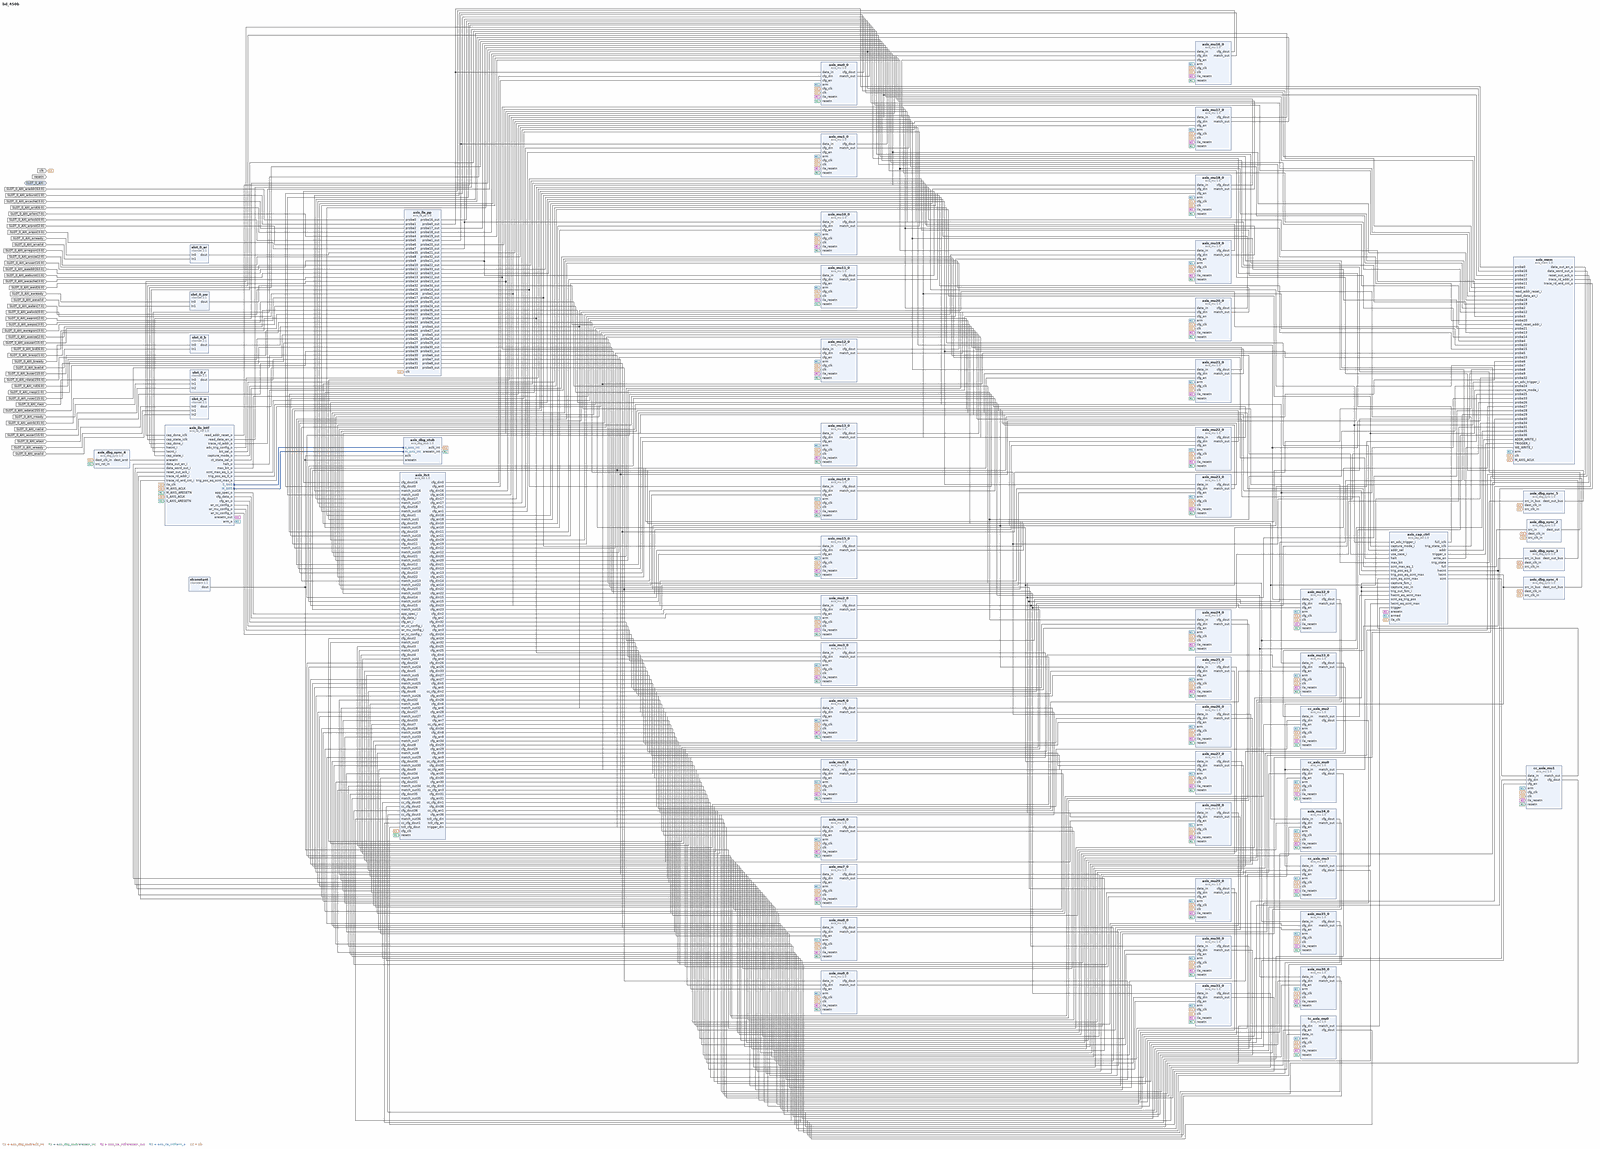
[diagram p0: block diagram of the top level, whole]
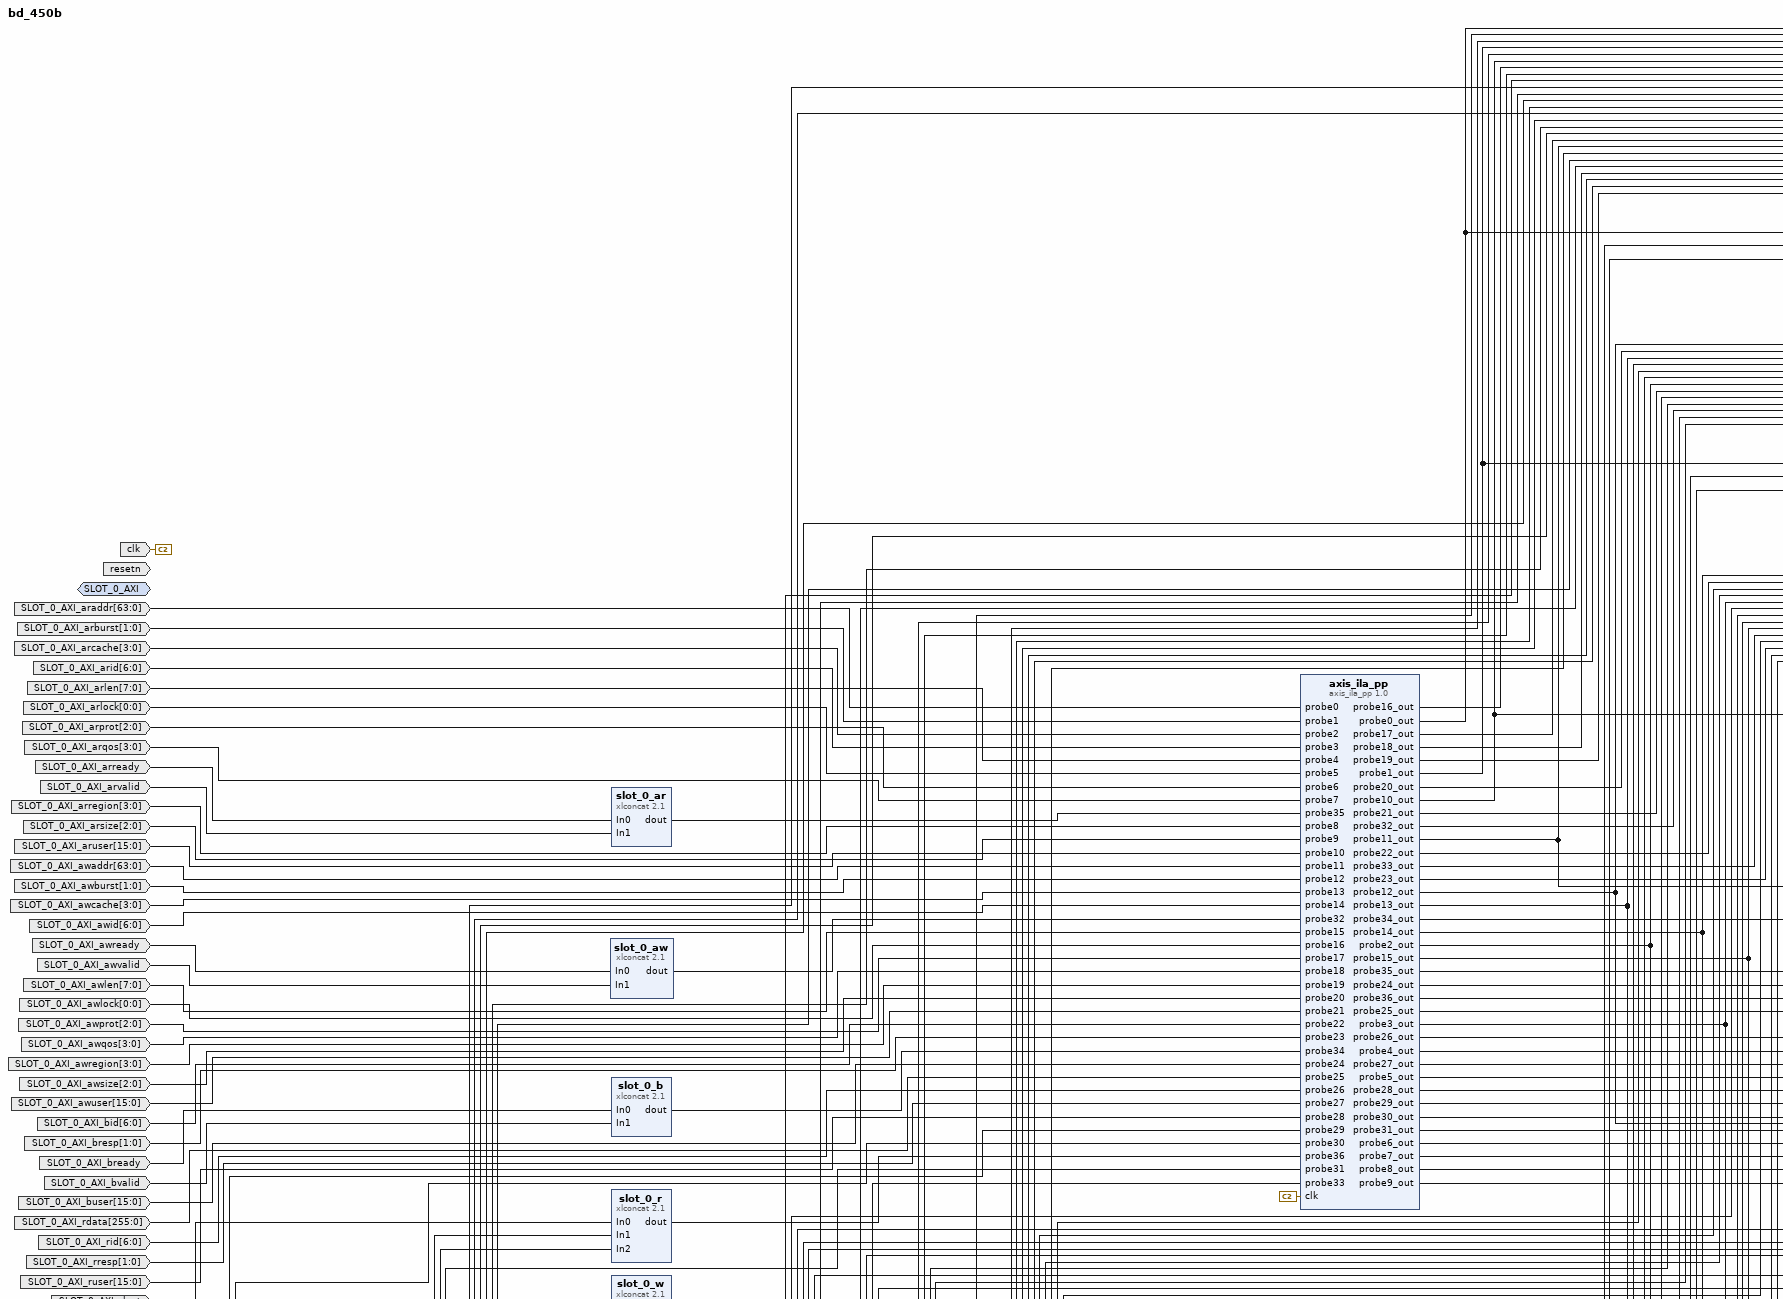
[diagram p1: block diagram of the top level, upper left part]
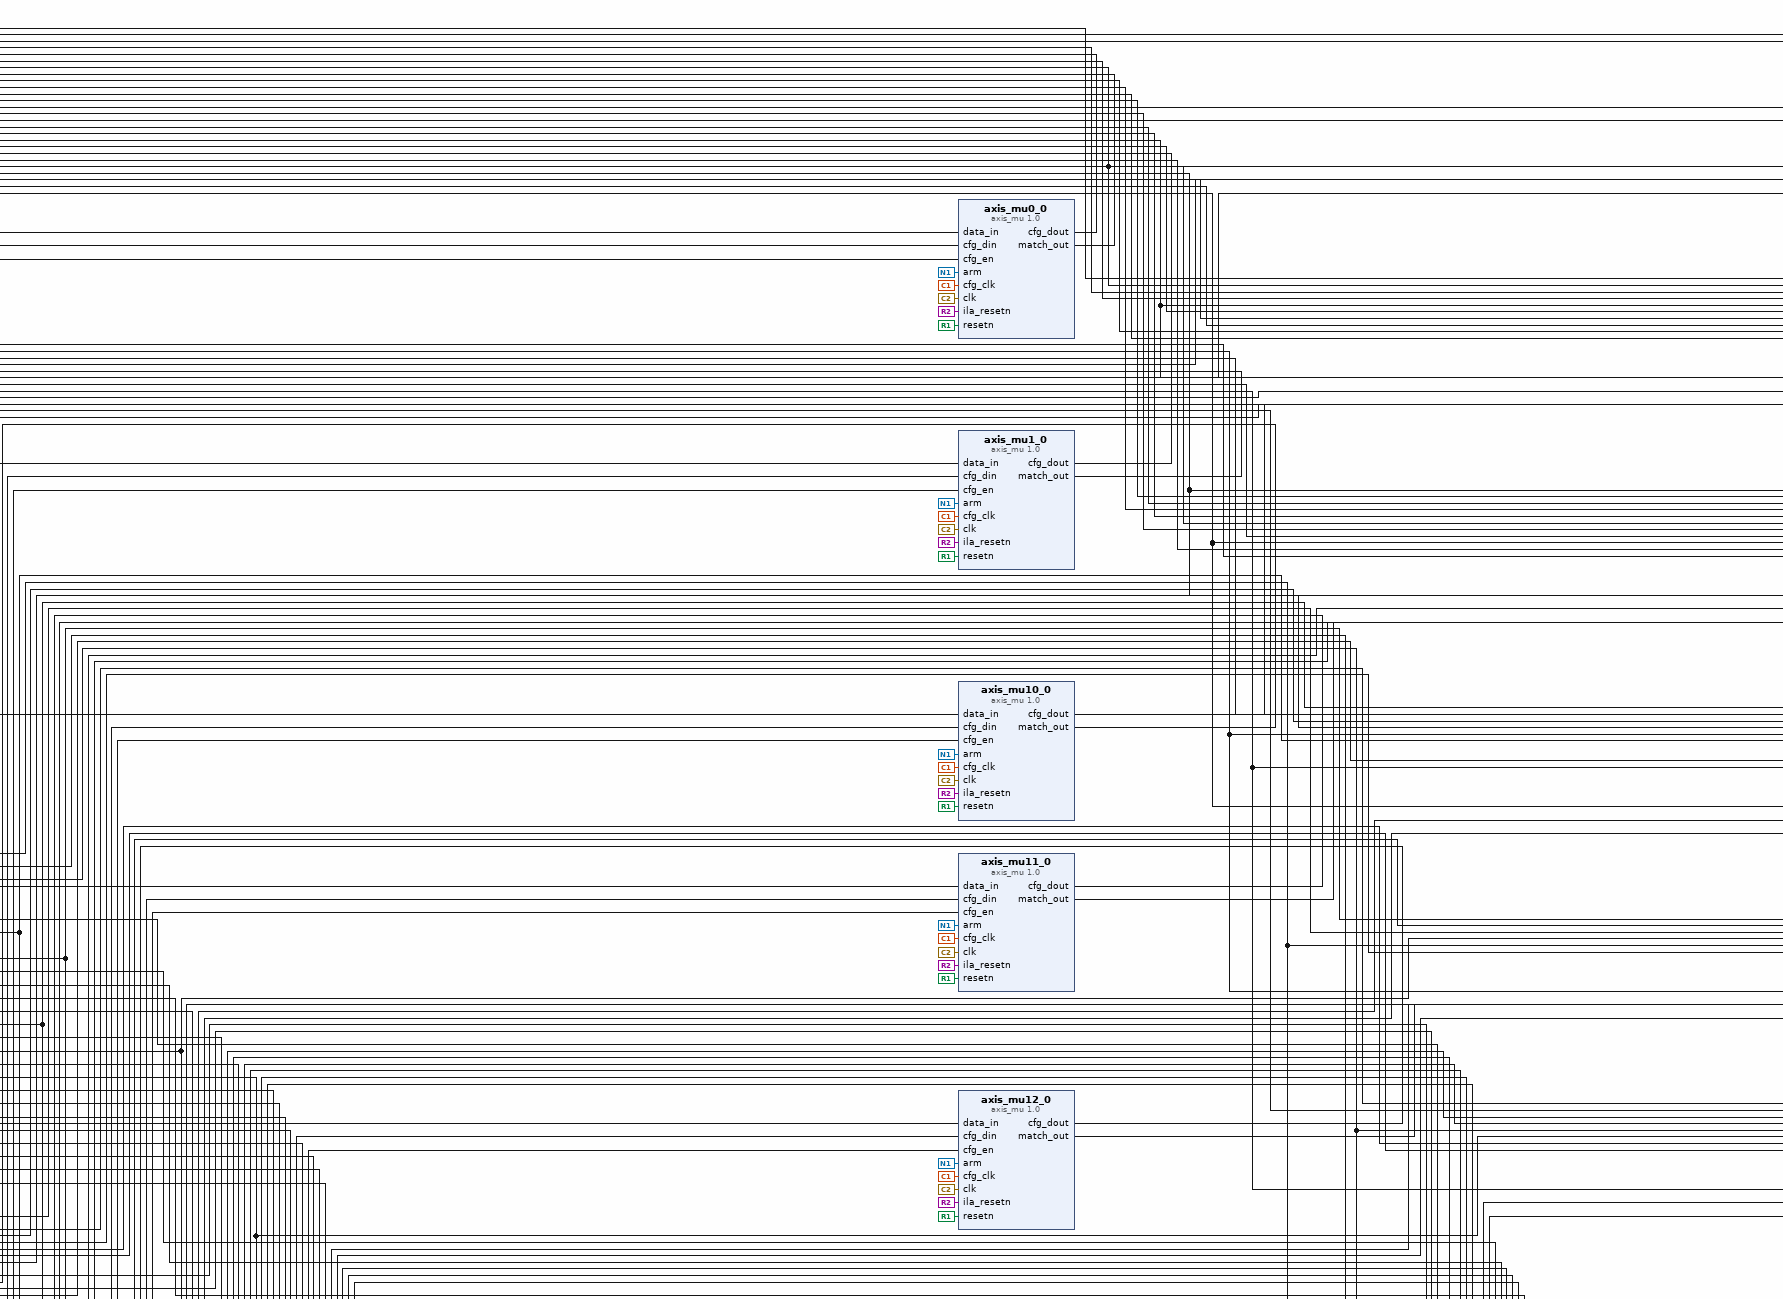
[diagram p2: block diagram of the top level, upper centre part]
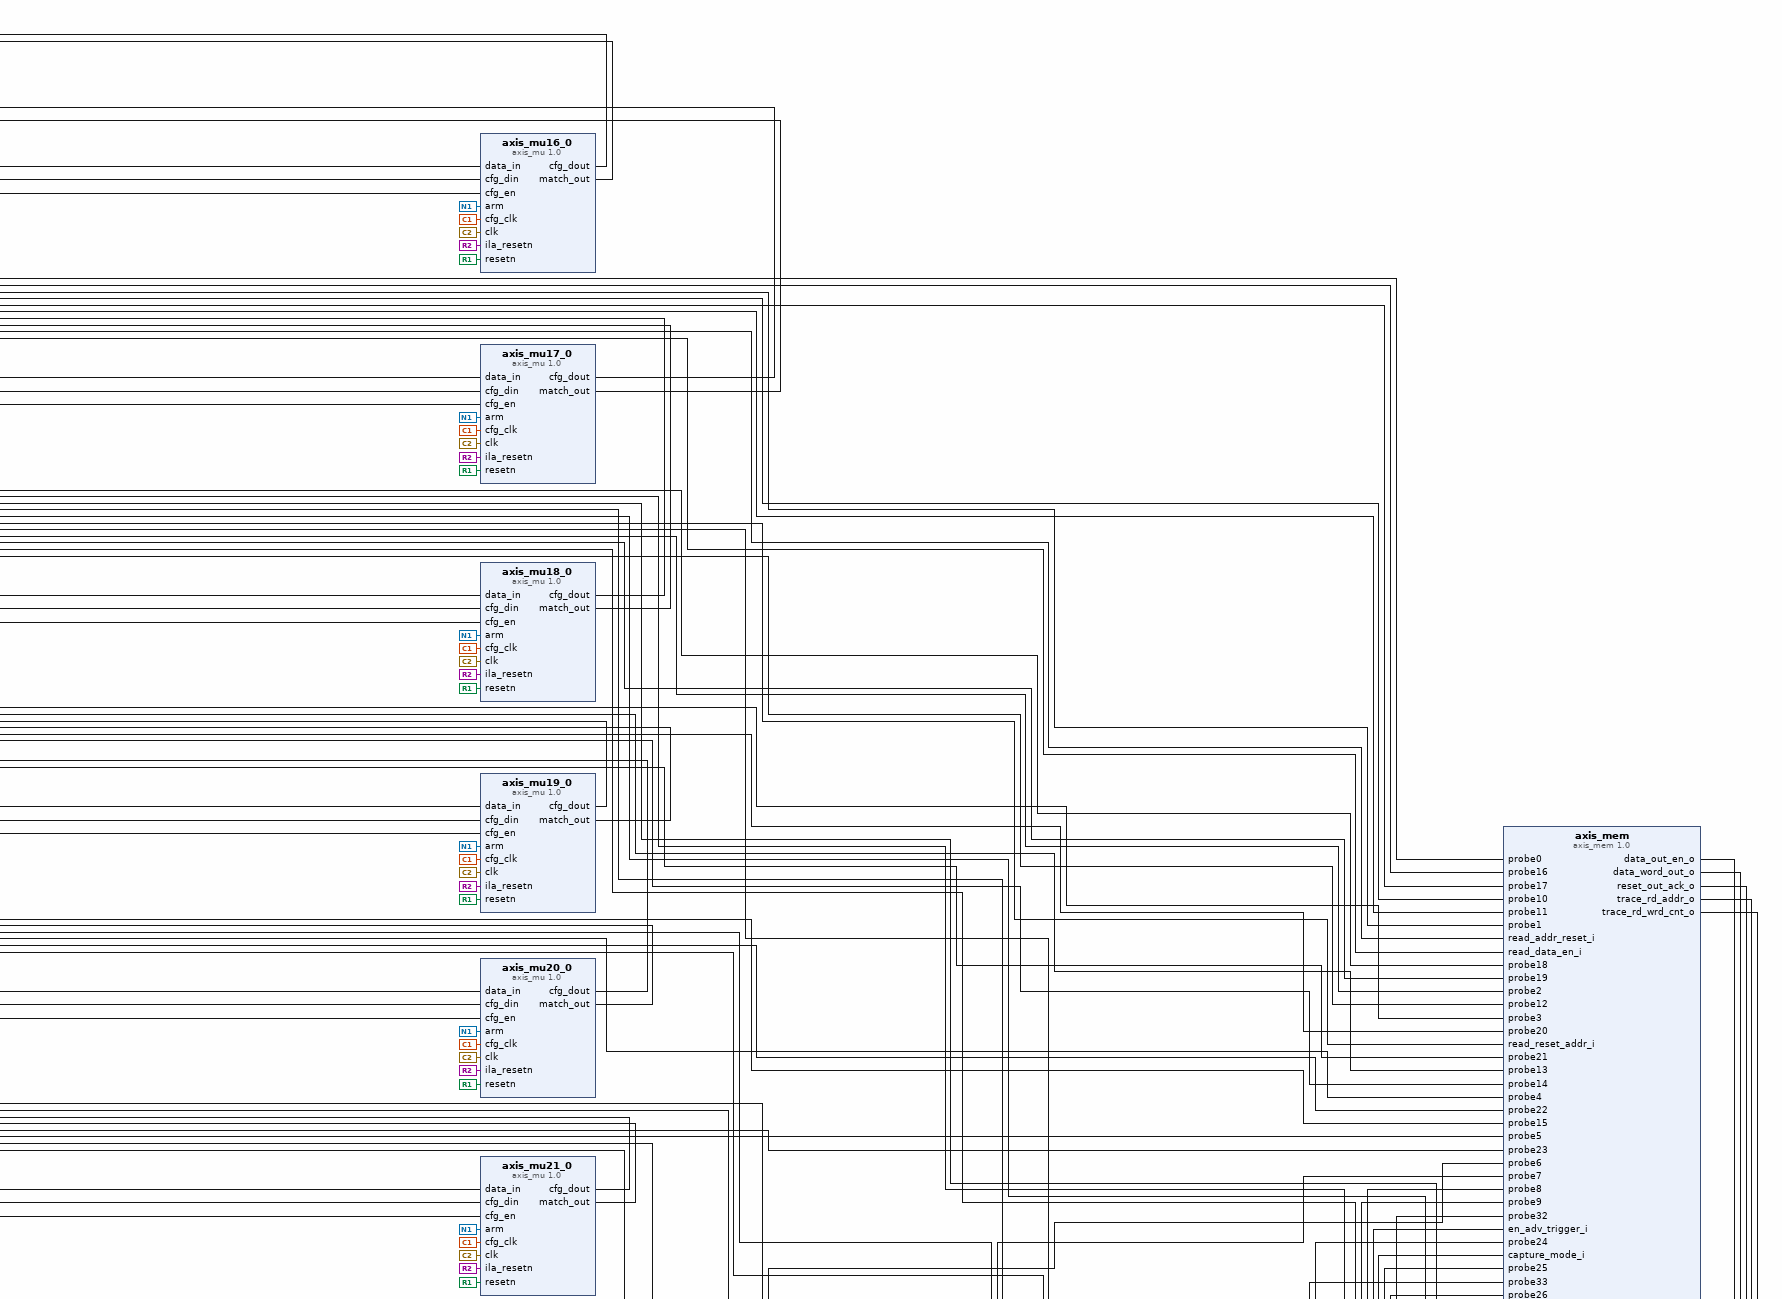
[diagram p3: block diagram of the top level, upper right part]
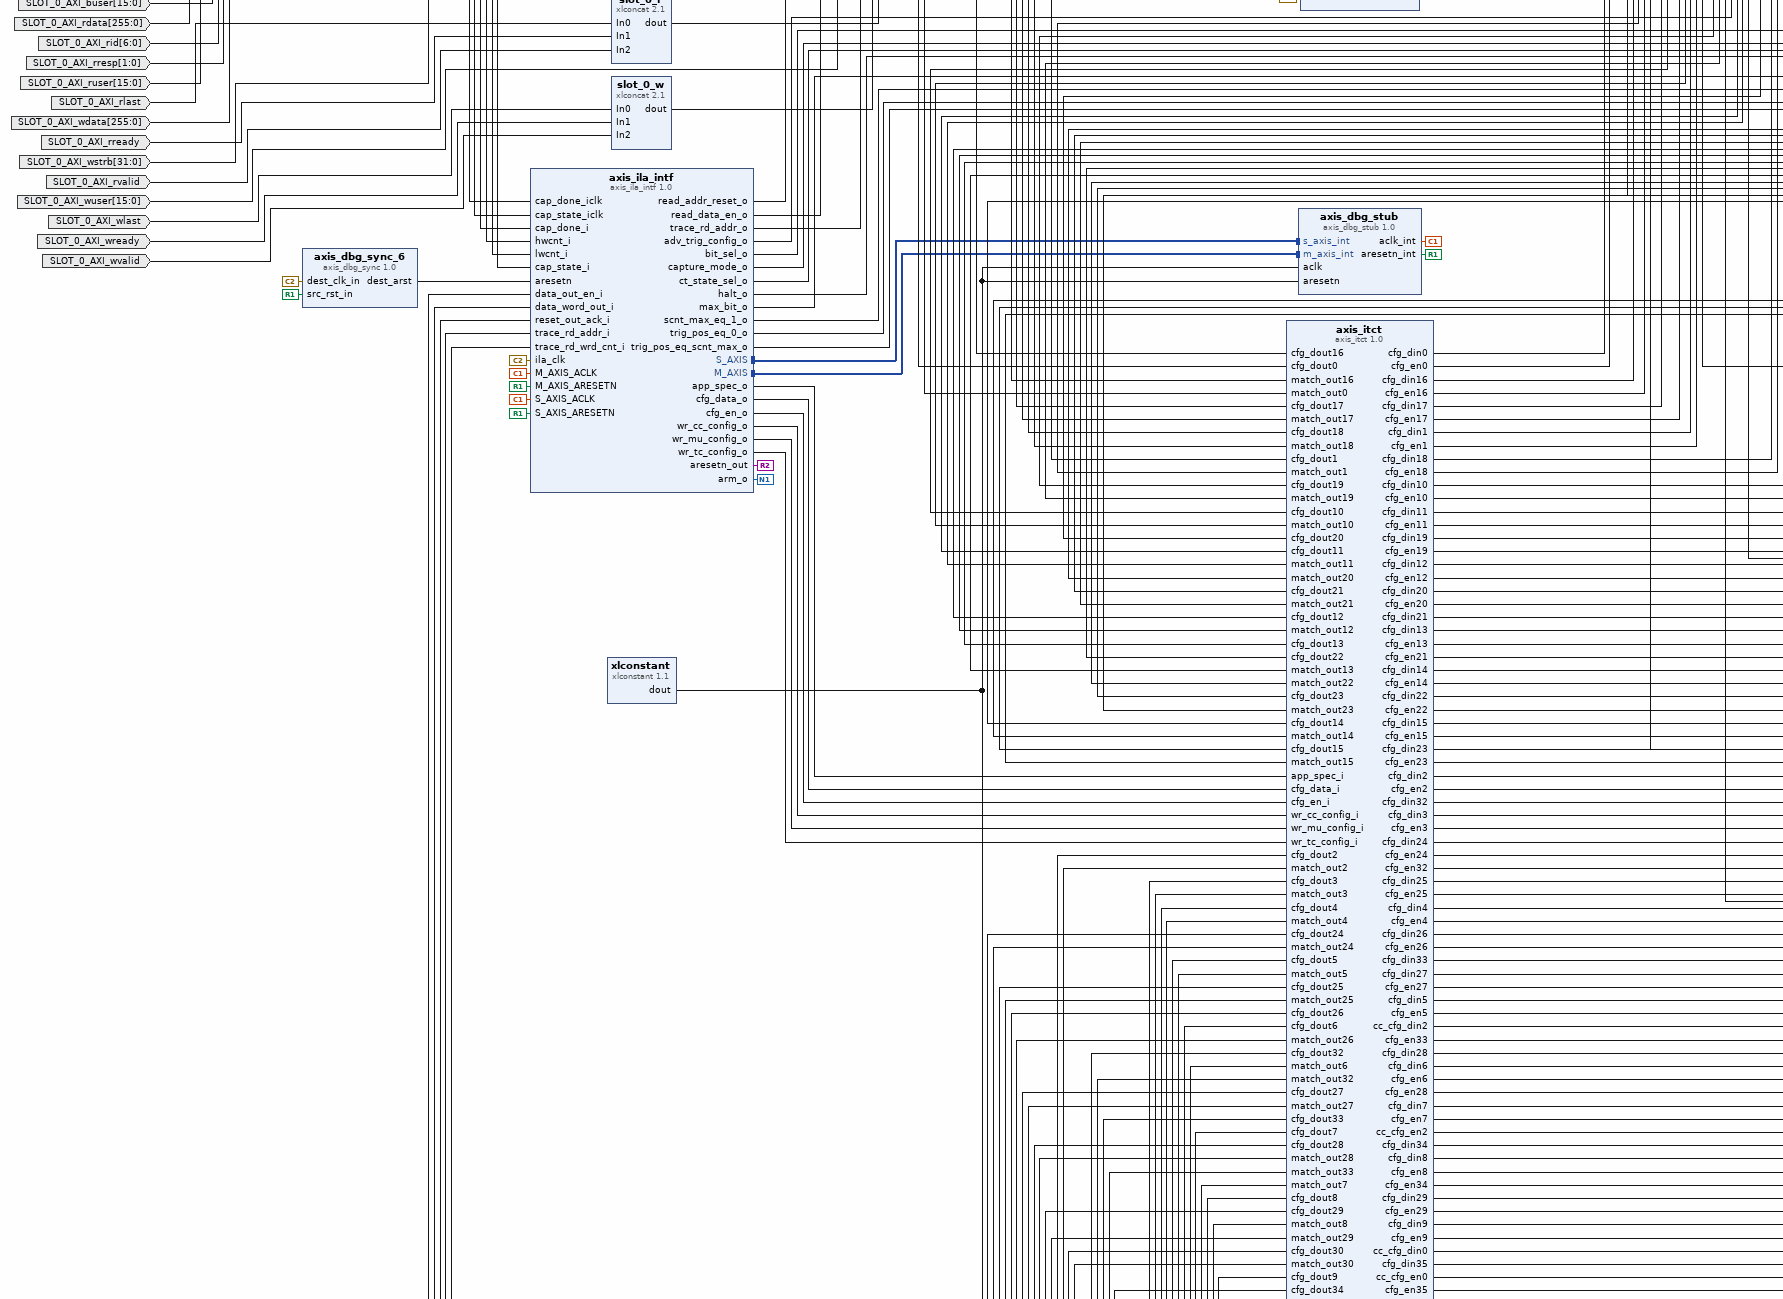
[diagram p4: block diagram of the top level, middle left part]
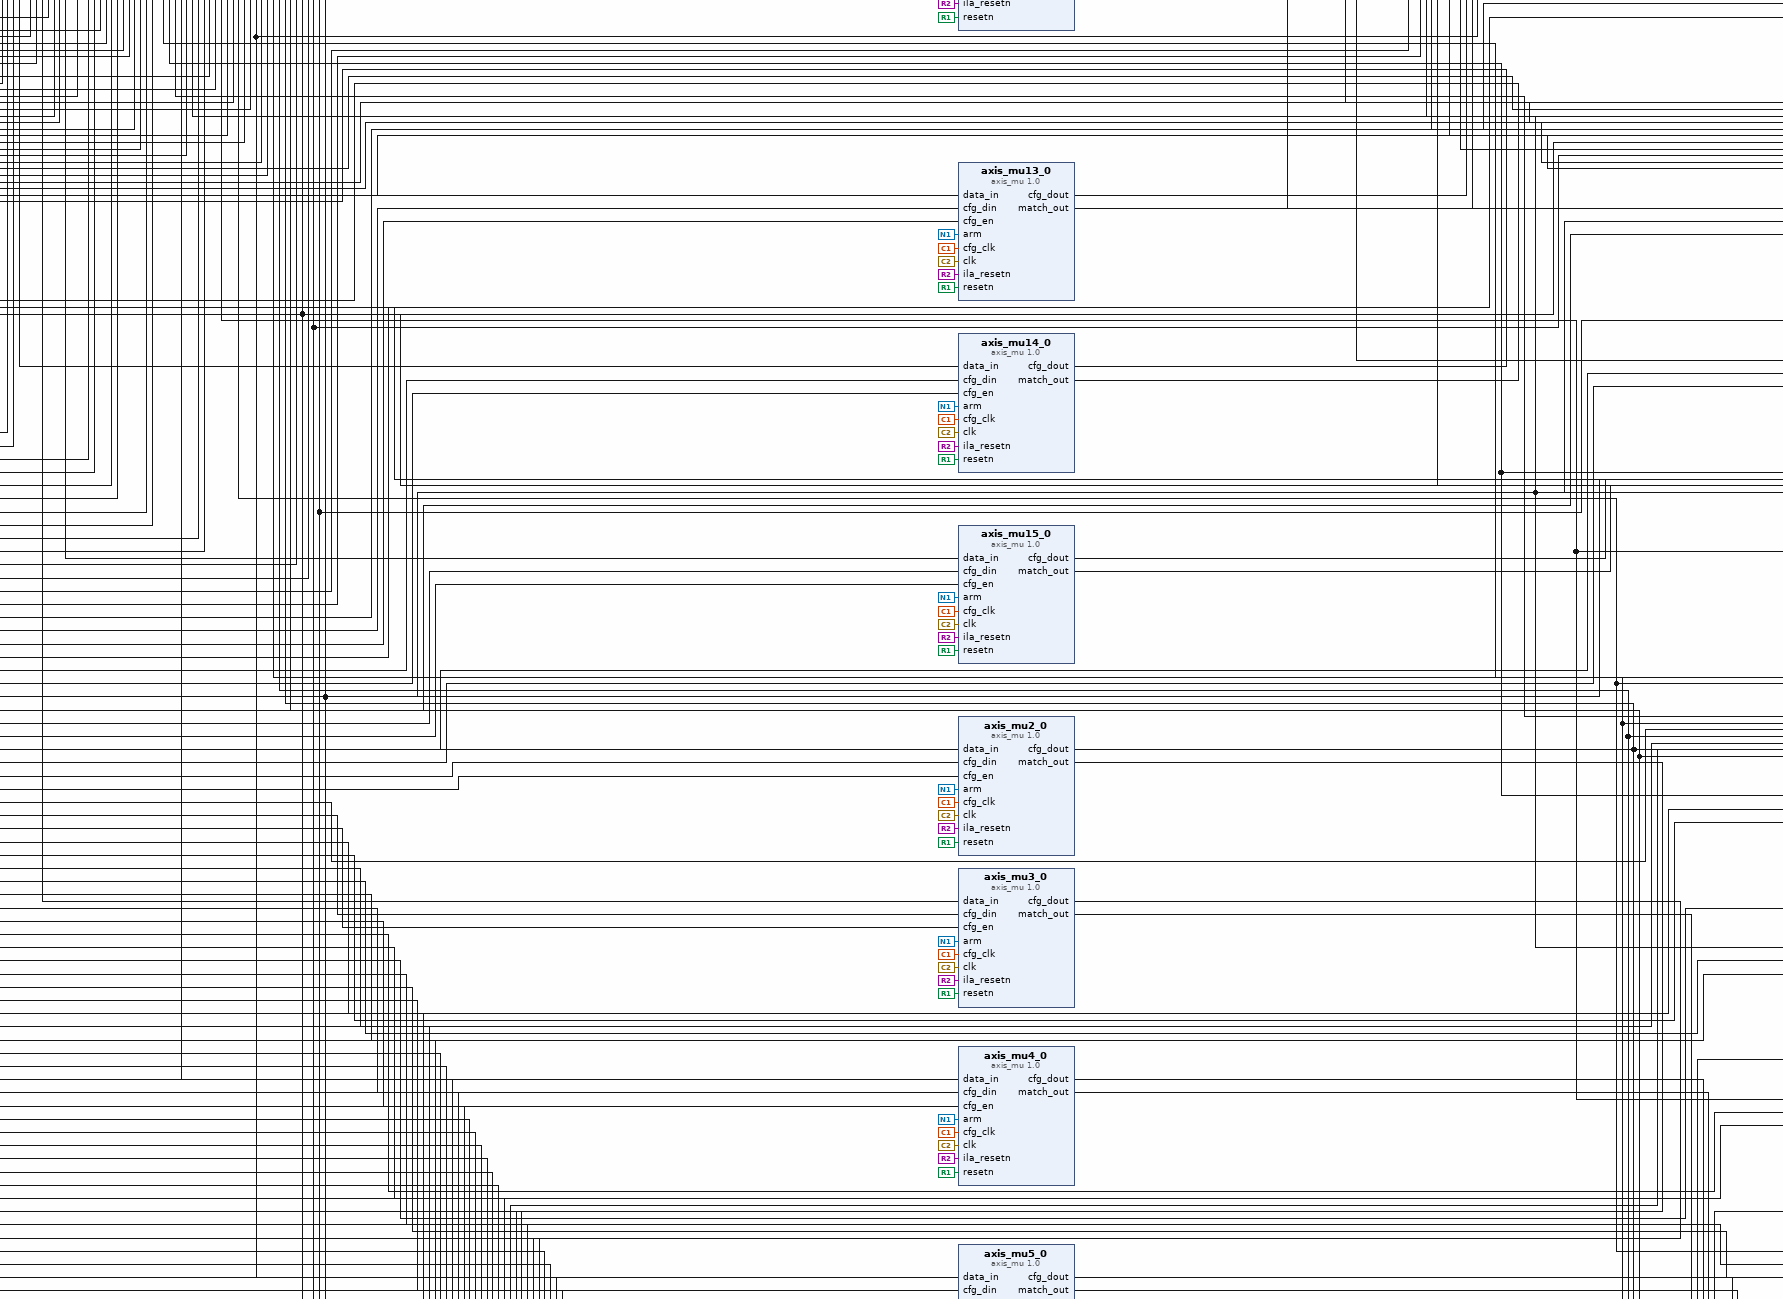
[diagram p5: block diagram of the top level, middle centre part]
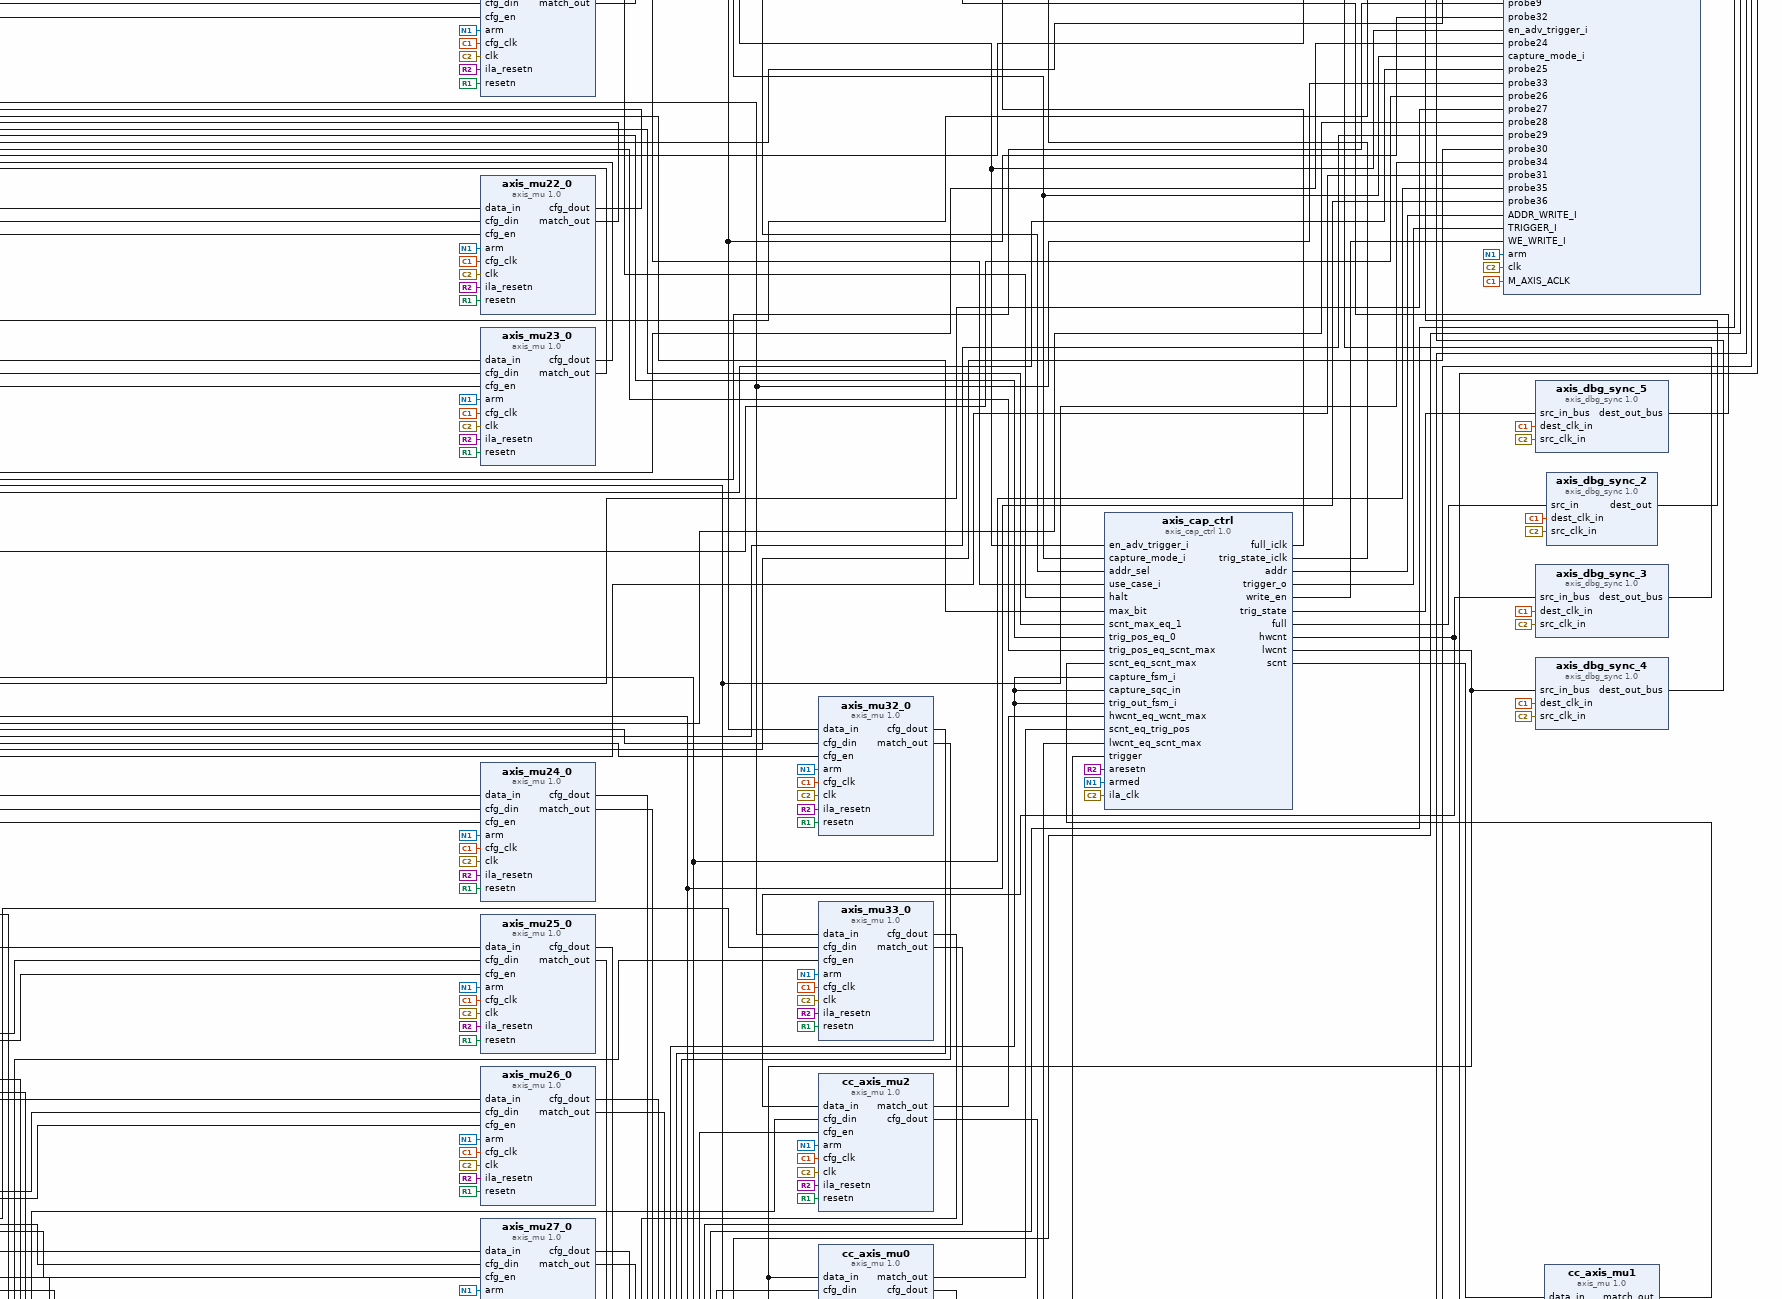
[diagram p6: block diagram of the top level, middle right part]
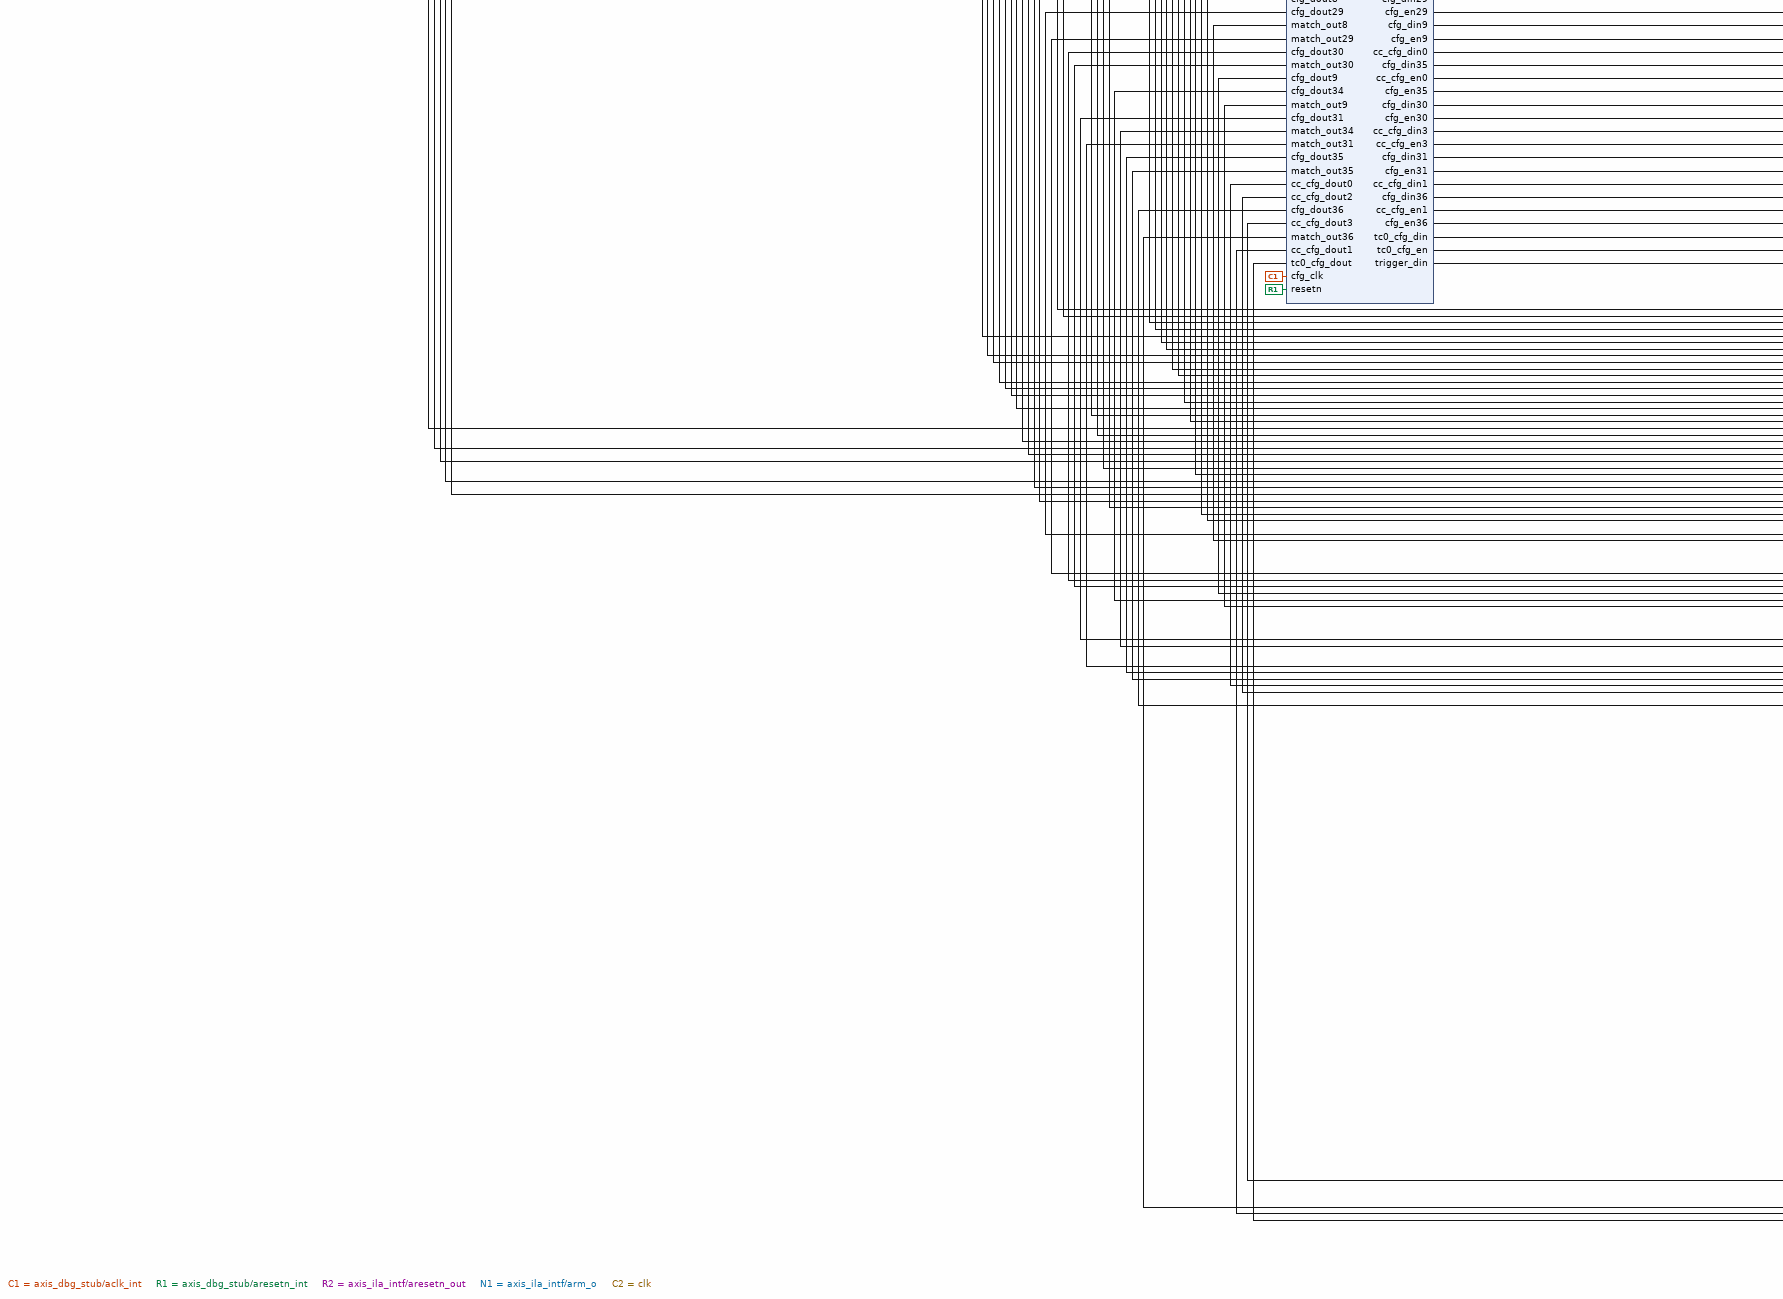
[diagram p7: block diagram of the top level, lower left part]
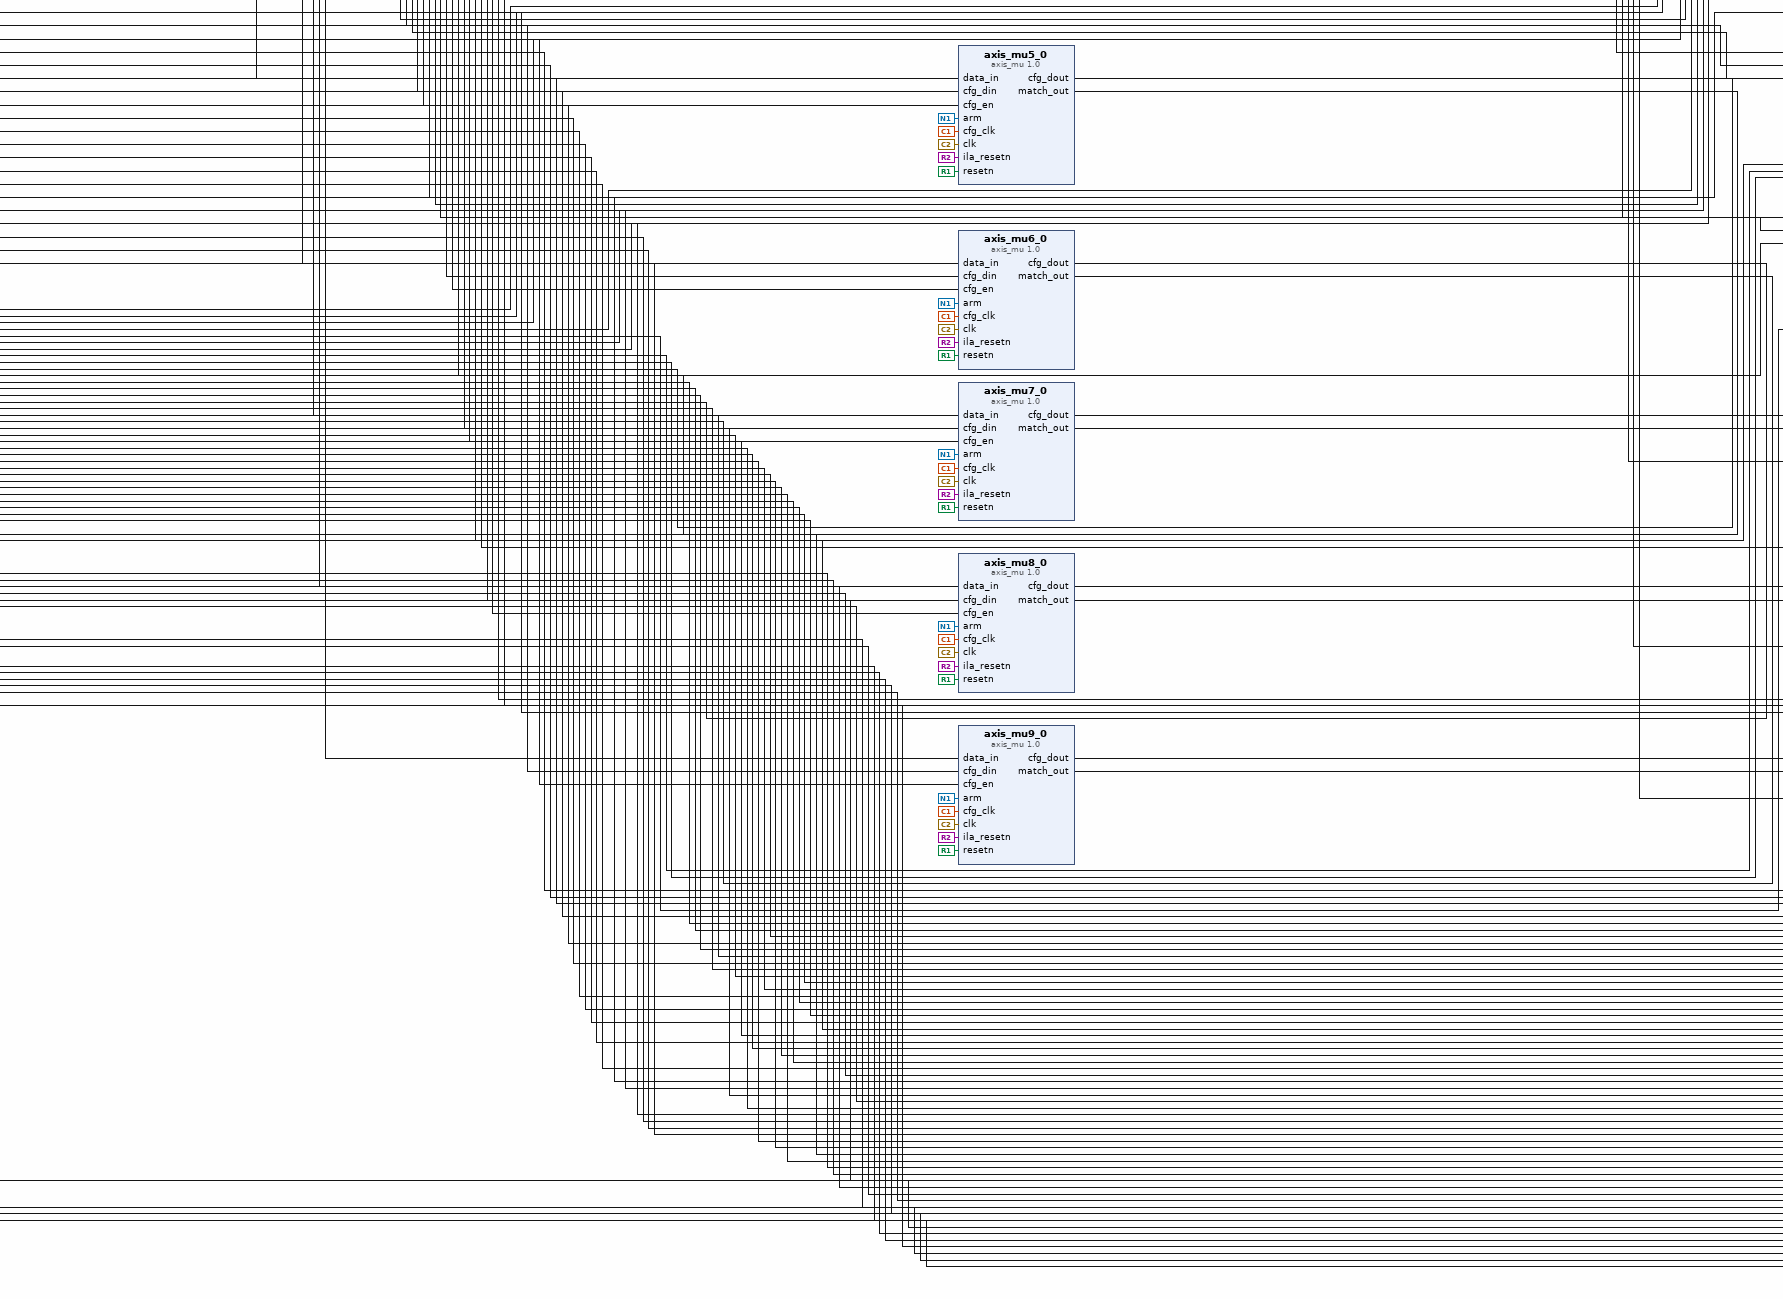
[diagram p8: block diagram of the top level, lower centre part]
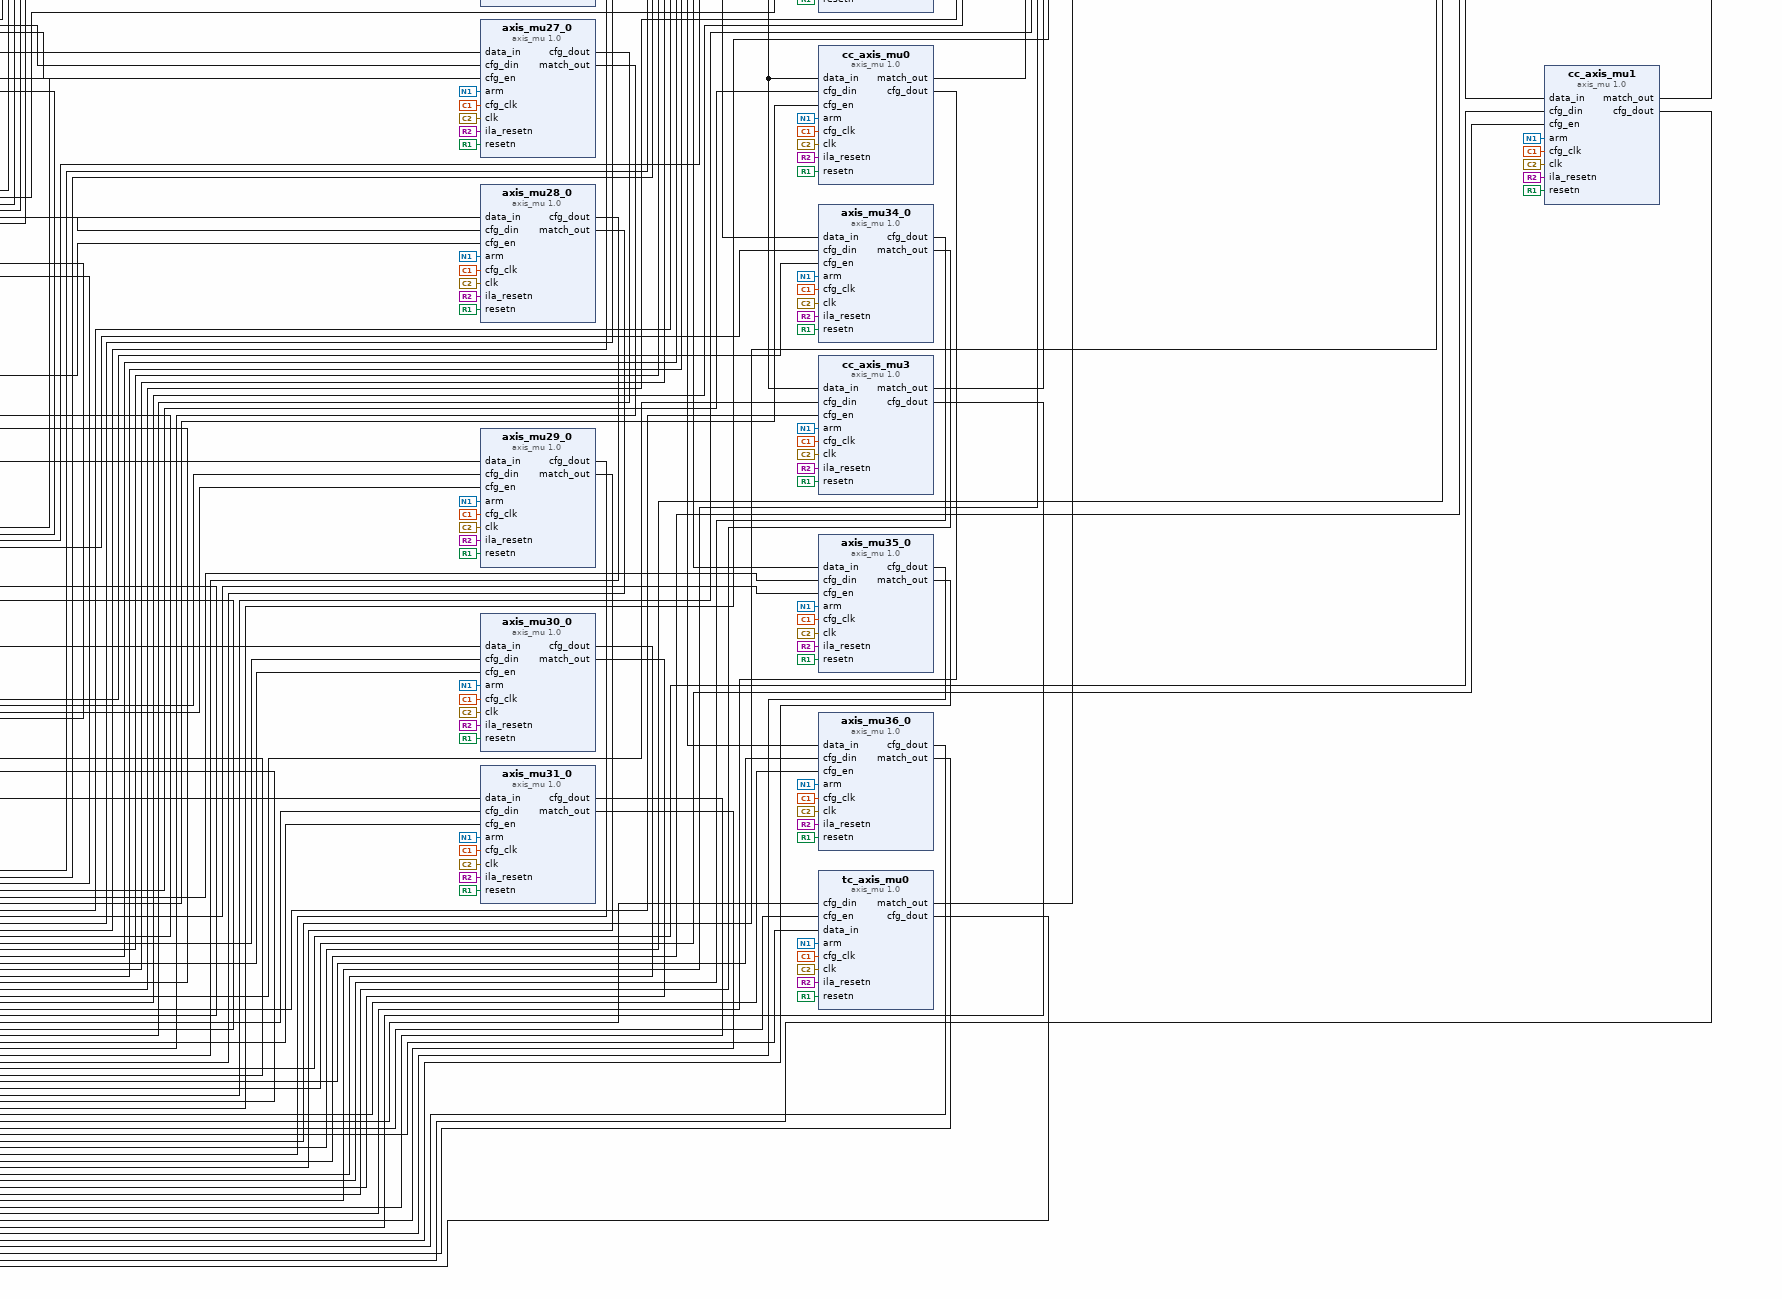
[diagram p9: block diagram of the top level, lower right part]
# Vivado block design bd_450b, xcvh1582-vsva3697-2MP-e-S, Vivado 2024.2
create_bd_design bd_450b

create_bd_intf_port -mode Monitor -vlnv xilinx.com:interface:aximm_rtl:1.0 SLOT_0_AXI
create_bd_port -dir I -type clk clk
set_property -dict {CONFIG.ASSOCIATED_BUSIF SLOT_0_AXI CONFIG.ASSOCIATED_RESET resetn} [get_bd_ports clk]
create_bd_port -dir I -type rst resetn
create_bd_port -dir I -from 63 -to 0 SLOT_0_AXI_araddr
create_bd_port -dir I -from 1 -to 0 SLOT_0_AXI_arburst
create_bd_port -dir I -from 3 -to 0 SLOT_0_AXI_arcache
create_bd_port -dir I -from 6 -to 0 SLOT_0_AXI_arid
create_bd_port -dir I -from 7 -to 0 SLOT_0_AXI_arlen
create_bd_port -dir I -from 0 -to 0 SLOT_0_AXI_arlock
create_bd_port -dir I -from 2 -to 0 SLOT_0_AXI_arprot
create_bd_port -dir I -from 3 -to 0 SLOT_0_AXI_arqos
create_bd_port -dir I SLOT_0_AXI_arready
create_bd_port -dir I -from 3 -to 0 SLOT_0_AXI_arregion
create_bd_port -dir I -from 2 -to 0 SLOT_0_AXI_arsize
create_bd_port -dir I -from 15 -to 0 SLOT_0_AXI_aruser
create_bd_port -dir I SLOT_0_AXI_arvalid
create_bd_port -dir I -from 63 -to 0 SLOT_0_AXI_awaddr
create_bd_port -dir I -from 1 -to 0 SLOT_0_AXI_awburst
create_bd_port -dir I -from 3 -to 0 SLOT_0_AXI_awcache
create_bd_port -dir I -from 6 -to 0 SLOT_0_AXI_awid
create_bd_port -dir I -from 7 -to 0 SLOT_0_AXI_awlen
create_bd_port -dir I -from 0 -to 0 SLOT_0_AXI_awlock
create_bd_port -dir I -from 2 -to 0 SLOT_0_AXI_awprot
create_bd_port -dir I -from 3 -to 0 SLOT_0_AXI_awqos
create_bd_port -dir I SLOT_0_AXI_awready
create_bd_port -dir I -from 3 -to 0 SLOT_0_AXI_awregion
create_bd_port -dir I -from 2 -to 0 SLOT_0_AXI_awsize
create_bd_port -dir I -from 15 -to 0 SLOT_0_AXI_awuser
create_bd_port -dir I SLOT_0_AXI_awvalid
create_bd_port -dir I -from 6 -to 0 SLOT_0_AXI_bid
create_bd_port -dir I SLOT_0_AXI_bready
create_bd_port -dir I -from 1 -to 0 SLOT_0_AXI_bresp
create_bd_port -dir I -from 15 -to 0 SLOT_0_AXI_buser
create_bd_port -dir I SLOT_0_AXI_bvalid
create_bd_port -dir I -from 255 -to 0 SLOT_0_AXI_rdata
create_bd_port -dir I -from 6 -to 0 SLOT_0_AXI_rid
create_bd_port -dir I SLOT_0_AXI_rlast
create_bd_port -dir I SLOT_0_AXI_rready
create_bd_port -dir I -from 1 -to 0 SLOT_0_AXI_rresp
create_bd_port -dir I -from 15 -to 0 SLOT_0_AXI_ruser
create_bd_port -dir I SLOT_0_AXI_rvalid
create_bd_port -dir I -from 255 -to 0 SLOT_0_AXI_wdata
create_bd_port -dir I SLOT_0_AXI_wlast
create_bd_port -dir I SLOT_0_AXI_wready
create_bd_port -dir I -from 31 -to 0 SLOT_0_AXI_wstrb
create_bd_port -dir I -from 15 -to 0 SLOT_0_AXI_wuser
create_bd_port -dir I SLOT_0_AXI_wvalid

create_bd_cell -type ip -vlnv xilinx.com:ip:xlconcat:2.1 slot_0_aw
create_bd_cell -type ip -vlnv xilinx.com:ip:xlconcat:2.1 slot_0_w
set_property -dict {CONFIG.NUM_PORTS 3} [get_bd_cells slot_0_w]
create_bd_cell -type ip -vlnv xilinx.com:ip:xlconcat:2.1 slot_0_b
create_bd_cell -type ip -vlnv xilinx.com:ip:xlconcat:2.1 slot_0_ar
create_bd_cell -type ip -vlnv xilinx.com:ip:xlconcat:2.1 slot_0_r
set_property -dict {CONFIG.NUM_PORTS 3} [get_bd_cells slot_0_r]
create_bd_cell -type ip -vlnv xilinx.com:ip:axis_dbg_stub:1.0 axis_dbg_stub
set_property -dict {CONFIG.C_AXIS_DATA_WIDTH 32} [get_bd_cells axis_dbg_stub]
create_bd_cell -type ip -vlnv xilinx.com:ip:xlconstant:1.1 xlconstant
set_property -dict {CONFIG.CONST_VAL 0} [get_bd_cells xlconstant]
create_bd_cell -type ip -vlnv xilinx.com:ip:axis_ila_intf:1.0 axis_ila_intf
